# Altium project DIOT_8ch_isoSPI.PrjPCB (part 3 of 3)
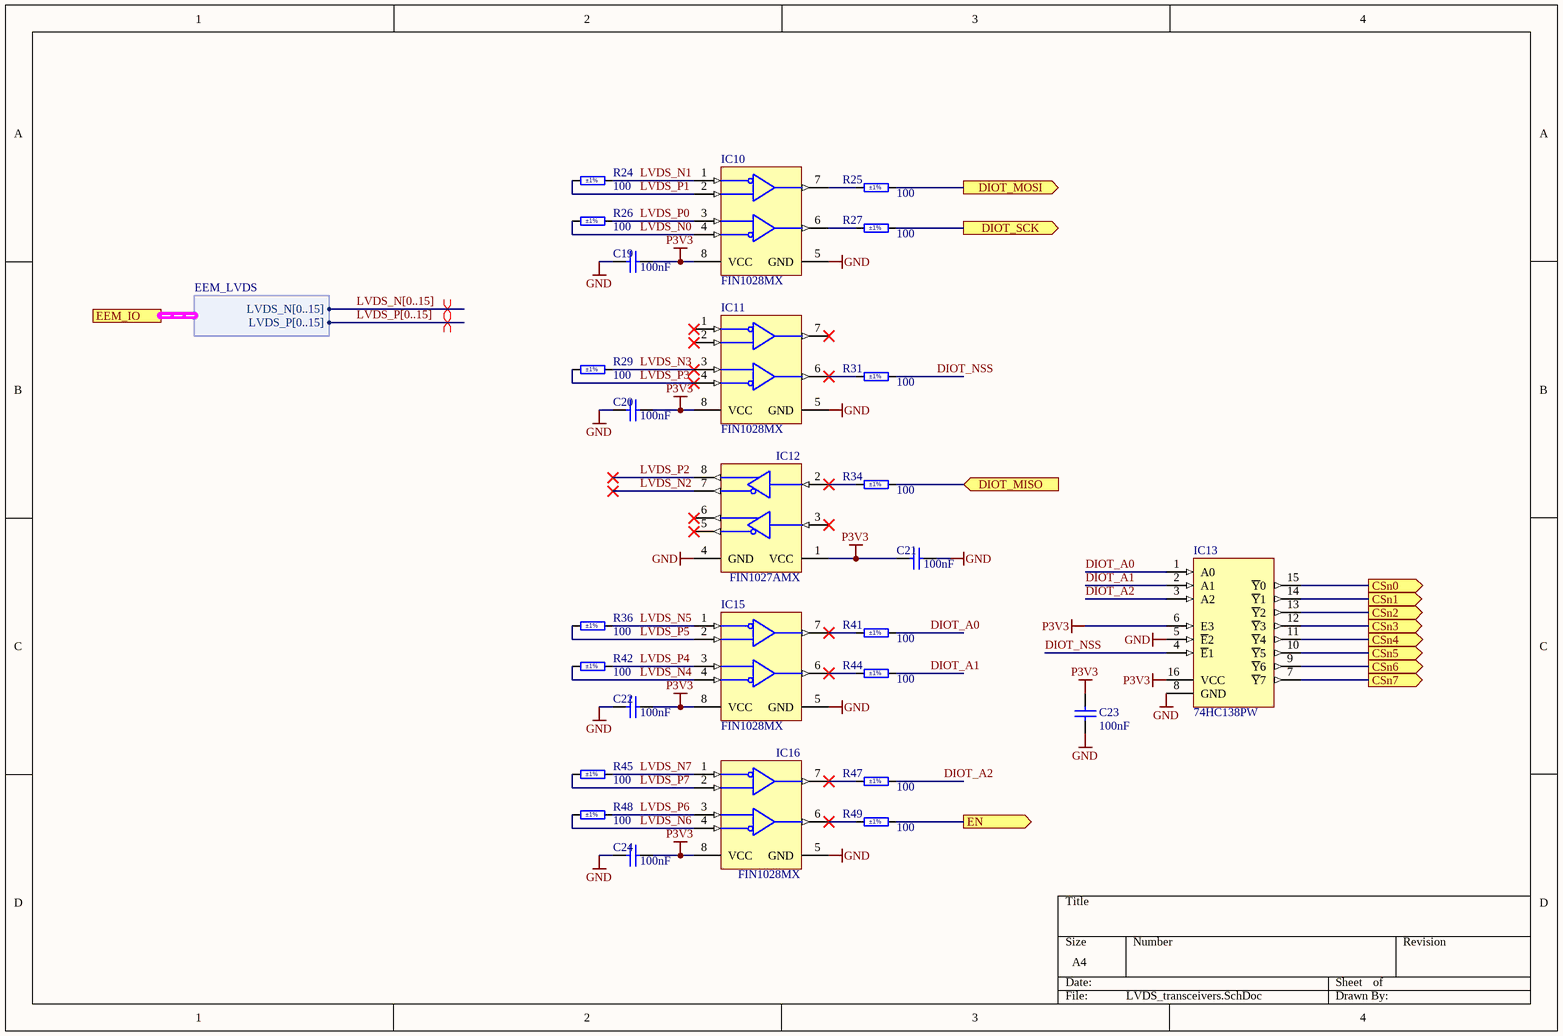
[diagram p6: LVDS_transceivers.SchDoc]

## Nets that join several sheets
GND: DIOT_8ch_isoSPI (35 pins), Power_Supplies (44 pins), CPCIS_Connectors_P1_P6 (66 pins), EEM_Connectors (35 pins), U_Iso_SPI_PHY_0 (13 pins), LVDS_transceivers (13 pins), U_Iso_SPI_PHY_1 (13 pins), U_Iso_SPI_PHY_2 (13 pins), U_Iso_SPI_PHY_3 (13 pins), U_Iso_SPI_PHY_4 (13 pins), U_Iso_SPI_PHY_5 (13 pins), U_Iso_SPI_PHY_6 (13 pins), U_Iso_SPI_PHY_7 (13 pins)
P3V3: Power_Supplies (5 pins), EEM_Connectors (C298.2 IC40.14), U_Iso_SPI_PHY_0 (11 pins), LVDS_transceivers (13 pins), U_Iso_SPI_PHY_1 (11 pins), U_Iso_SPI_PHY_2 (11 pins), U_Iso_SPI_PHY_3 (11 pins), U_Iso_SPI_PHY_4 (11 pins), U_Iso_SPI_PHY_5 (11 pins), U_Iso_SPI_PHY_6 (11 pins), U_Iso_SPI_PHY_7 (11 pins)
P3V3_DIOT: Power_Supplies (C102.1 D11.2 IC14.5), CPCIS_Connectors_P1_P6 (13 pins)
P3V3_MP: Power_Supplies (5 pins), EEM_Connectors (5 pins)
P5V0: Power_Supplies (C7.2 C9.1 L4.2), U_Iso_SPI_PHY_0 (F1A.2 T5A.2), U_Iso_SPI_PHY_1 (F1B.2 T5B.2), U_Iso_SPI_PHY_2 (F1C.2 T5C.2), U_Iso_SPI_PHY_3 (F1D.2 T5D.2), U_Iso_SPI_PHY_4 (F1E.2 T5E.2), U_Iso_SPI_PHY_5 (F1F.2 T5F.2), U_Iso_SPI_PHY_6 (F1G.2 T5G.2), U_Iso_SPI_PHY_7 (F1H.2 T5H.2)
P12V0: Power_Supplies (14 pins), EEM_Connectors (8 pins)
P12V0_DIOT: Power_Supplies (C40.2 IC14.1 IC14.3), CPCIS_Connectors_P1_P6 (7 pins), EEM_Connectors (R257.1 R260.1 R261.1 R262.1)
BP_I2C.SCL: CPCIS_Connectors_P1_P6 (D5.3 J6.B2), EEM_Connectors (R77.1)
BP_I2C.SDA: CPCIS_Connectors_P1_P6 (D5.1 J6.C2), EEM_Connectors (R3.1)
BP_IO.LVDS_N0: CPCIS_Connectors_P1_P6 (J6.E3), EEM_Connectors (R161.1)
BP_IO.LVDS_N1: CPCIS_Connectors_P1_P6 (J6.B3), EEM_Connectors (R162.1)
BP_IO.LVDS_N2: CPCIS_Connectors_P1_P6 (J6.C4), EEM_Connectors (R163.1)
BP_IO.LVDS_N3: CPCIS_Connectors_P1_P6 (J6.L4), EEM_Connectors (R164.1)
BP_IO.LVDS_N4: CPCIS_Connectors_P1_P6 (J6.I4), EEM_Connectors (R167.1)
BP_IO.LVDS_N5: CPCIS_Connectors_P1_P6 (J6.K5), EEM_Connectors (R168.1)
BP_IO.LVDS_N6: CPCIS_Connectors_P1_P6 (J6.H5), EEM_Connectors (R169.1)
BP_IO.LVDS_N7: CPCIS_Connectors_P1_P6 (J6.F6), EEM_Connectors (R170.1)
BP_IO.LVDS_N8: CPCIS_Connectors_P1_P6 (J6.C6), EEM_Connectors (R171.1)
BP_IO.LVDS_N9: CPCIS_Connectors_P1_P6 (J6.L6), EEM_Connectors (R172.1)
BP_IO.LVDS_N10: CPCIS_Connectors_P1_P6 (J6.I6), EEM_Connectors (R173.1)
BP_IO.LVDS_N11: CPCIS_Connectors_P1_P6 (J7.E1), EEM_Connectors (R174.1)
BP_IO.LVDS_N12: CPCIS_Connectors_P1_P6 (J7.B1), EEM_Connectors (R175.1)
BP_IO.LVDS_N13: CPCIS_Connectors_P1_P6 (J7.K1), EEM_Connectors (R176.1)
BP_IO.LVDS_N14: CPCIS_Connectors_P1_P6 (J7.H1), EEM_Connectors (R177.1)
BP_IO.LVDS_N15: CPCIS_Connectors_P1_P6 (J6.F2), EEM_Connectors (R144.2)
BP_IO.LVDS_P0: CPCIS_Connectors_P1_P6 (J6.D3), EEM_Connectors (R145.1)
BP_IO.LVDS_P1: CPCIS_Connectors_P1_P6 (J6.A3), EEM_Connectors (R146.1)
BP_IO.LVDS_P2: CPCIS_Connectors_P1_P6 (J6.B4), EEM_Connectors (R147.1)
BP_IO.LVDS_P3: CPCIS_Connectors_P1_P6 (J6.K4), EEM_Connectors (R148.1)
BP_IO.LVDS_P4: CPCIS_Connectors_P1_P6 (J6.H4), EEM_Connectors (R149.1)
BP_IO.LVDS_P5: CPCIS_Connectors_P1_P6 (J6.J5), EEM_Connectors (R150.1)
BP_IO.LVDS_P6: CPCIS_Connectors_P1_P6 (J6.G5), EEM_Connectors (R151.1)
BP_IO.LVDS_P7: CPCIS_Connectors_P1_P6 (J6.E6), EEM_Connectors (R152.1)
BP_IO.LVDS_P8: CPCIS_Connectors_P1_P6 (J6.B6), EEM_Connectors (R5.1)
BP_IO.LVDS_P9: CPCIS_Connectors_P1_P6 (J6.K6), EEM_Connectors (R6.1)
BP_IO.LVDS_P10: CPCIS_Connectors_P1_P6 (J6.H6), EEM_Connectors (R7.1)
BP_IO.LVDS_P11: CPCIS_Connectors_P1_P6 (J7.D1), EEM_Connectors (R156.1)
BP_IO.LVDS_P12: CPCIS_Connectors_P1_P6 (J7.A1), EEM_Connectors (R157.1)
BP_IO.LVDS_P13: CPCIS_Connectors_P1_P6 (J7.J1), EEM_Connectors (R158.1)
BP_IO.LVDS_P14: CPCIS_Connectors_P1_P6 (J7.G1), EEM_Connectors (R159.1)
BP_IO.LVDS_P15: CPCIS_Connectors_P1_P6 (J6.E2), EEM_Connectors (R143.2)
CSn0: U_Iso_SPI_PHY_0 (IC5A.5 IC7A.1), LVDS_transceivers (IC13.15)
CSn1: LVDS_transceivers (IC13.14), U_Iso_SPI_PHY_1 (IC5B.5 IC7B.1)
CSn2: LVDS_transceivers (IC13.13), U_Iso_SPI_PHY_2 (IC5C.5 IC7C.1)
CSn3: LVDS_transceivers (IC13.12), U_Iso_SPI_PHY_3 (IC5D.5 IC7D.1)
CSn4: LVDS_transceivers (IC13.11), U_Iso_SPI_PHY_4 (IC5E.5 IC7E.1)
CSn5: LVDS_transceivers (IC13.10), U_Iso_SPI_PHY_5 (IC5F.5 IC7F.1)
CSn6: LVDS_transceivers (IC13.9), U_Iso_SPI_PHY_6 (IC5G.5 IC7G.1)
CSn7: LVDS_transceivers (IC13.7), U_Iso_SPI_PHY_7 (IC5H.5 IC7H.1)
EEM0_I2C.SCL: Power_Supplies (IC33.2), EEM_Connectors (6 pins)
EEM0_I2C.SDA: Power_Supplies (IC33.1), EEM_Connectors (6 pins)
EEM_IO.LVDS_N0: EEM_Connectors (J8.3 R161.2), LVDS_transceivers (IC10.4 R26.2)
EEM_IO.LVDS_N1: EEM_Connectors (J8.6 R162.2), LVDS_transceivers (IC10.1 R24.1)
EEM_IO.LVDS_N2: EEM_Connectors (J8.9 R163.2), LVDS_transceivers (IC12.7)
EEM_IO.LVDS_N3: EEM_Connectors (J8.12 R164.2), LVDS_transceivers (IC11.3 R29.1)
EEM_IO.LVDS_N4: EEM_Connectors (J8.15 R167.2), LVDS_transceivers (IC15.4 R42.2)
EEM_IO.LVDS_N5: EEM_Connectors (J8.18 R168.2), LVDS_transceivers (IC15.1 R36.1)
EEM_IO.LVDS_N6: EEM_Connectors (J8.21 R169.2), LVDS_transceivers (IC16.4 R48.2)
EEM_IO.LVDS_N7: EEM_Connectors (J8.24 R170.2), LVDS_transceivers (IC16.1 R45.1)
EEM_IO.LVDS_P0: EEM_Connectors (J8.2 R145.2), LVDS_transceivers (IC10.3 R26.1)
EEM_IO.LVDS_P1: EEM_Connectors (J8.5 R146.2), LVDS_transceivers (IC10.2 R24.2)
EEM_IO.LVDS_P2: EEM_Connectors (J8.8 R147.2), LVDS_transceivers (IC12.8)
EEM_IO.LVDS_P3: EEM_Connectors (J8.11 R148.2), LVDS_transceivers (IC11.4 R29.2)
EEM_IO.LVDS_P4: EEM_Connectors (J8.14 R149.2), LVDS_transceivers (IC15.3 R42.1)
EEM_IO.LVDS_P5: EEM_Connectors (J8.17 R150.2), LVDS_transceivers (IC15.2 R36.2)
EEM_IO.LVDS_P6: EEM_Connectors (J8.20 R151.2), LVDS_transceivers (IC16.3 R48.1)
EEM_IO.LVDS_P7: EEM_Connectors (J8.23 R152.2), LVDS_transceivers (IC16.2 R45.2)
ISO_N: DIOT_8ch_isoSPI (TR2.2), U_Iso_SPI_PHY_3 (D3D.3 IC5D.10 R13D.2)
ISO_N: DIOT_8ch_isoSPI (TR2.5), U_Iso_SPI_PHY_2 (D3C.3 IC5C.10 R13C.2)
ISO_N: DIOT_8ch_isoSPI (TR2.8), U_Iso_SPI_PHY_1 (D3B.3 IC5B.10 R13B.2)
ISO_N: DIOT_8ch_isoSPI (TR2.11), U_Iso_SPI_PHY_0 (D3A.3 IC5A.10 R13A.2)
ISO_N: DIOT_8ch_isoSPI (TR3.2), U_Iso_SPI_PHY_7 (D3H.3 IC5H.10 R13H.2)
ISO_N: DIOT_8ch_isoSPI (TR3.5), U_Iso_SPI_PHY_6 (D3G.3 IC5G.10 R13G.2)
ISO_N: DIOT_8ch_isoSPI (TR3.8), U_Iso_SPI_PHY_5 (D3F.3 IC5F.10 R13F.2)
ISO_N: DIOT_8ch_isoSPI (TR3.11), U_Iso_SPI_PHY_4 (D3E.3 IC5E.10 R13E.2)
ISO_P: DIOT_8ch_isoSPI (TR2.3), U_Iso_SPI_PHY_3 (D3D.1 IC5D.11 R13D.1)
ISO_P: DIOT_8ch_isoSPI (TR2.6), U_Iso_SPI_PHY_2 (D3C.1 IC5C.11 R13C.1)
ISO_P: DIOT_8ch_isoSPI (TR2.9), U_Iso_SPI_PHY_1 (D3B.1 IC5B.11 R13B.1)
ISO_P: DIOT_8ch_isoSPI (TR2.12), U_Iso_SPI_PHY_0 (D3A.1 IC5A.11 R13A.1)
ISO_P: DIOT_8ch_isoSPI (TR3.3), U_Iso_SPI_PHY_7 (D3H.1 IC5H.11 R13H.1)
ISO_P: DIOT_8ch_isoSPI (TR3.6), U_Iso_SPI_PHY_6 (D3G.1 IC5G.11 R13G.1)
ISO_P: DIOT_8ch_isoSPI (TR3.9), U_Iso_SPI_PHY_5 (D3F.1 IC5F.11 R13F.1)
ISO_P: DIOT_8ch_isoSPI (TR3.12), U_Iso_SPI_PHY_4 (D3E.1 IC5E.11 R13E.1)
LEDG0: DIOT_8ch_isoSPI (LD3.2), U_Iso_SPI_PHY_0 (R22A.2)
LEDG1: DIOT_8ch_isoSPI (LD6.2), U_Iso_SPI_PHY_1 (R22B.2)
LEDG2: DIOT_8ch_isoSPI (LD8.2), U_Iso_SPI_PHY_2 (R22C.2)
LEDG3: DIOT_8ch_isoSPI (LD10.2), U_Iso_SPI_PHY_3 (R22D.2)
LEDG4: DIOT_8ch_isoSPI (LD12.2), U_Iso_SPI_PHY_4 (R22E.2)
LEDG5: DIOT_8ch_isoSPI (LD14.2), U_Iso_SPI_PHY_5 (R22F.2)
LEDG6: DIOT_8ch_isoSPI (LD16.2), U_Iso_SPI_PHY_6 (R22G.2)
LEDG7: DIOT_8ch_isoSPI (LD18.2), U_Iso_SPI_PHY_7 (R22H.2)
LEDR0: DIOT_8ch_isoSPI (LD5.2), U_Iso_SPI_PHY_0 (R21A.1)
LEDR1: DIOT_8ch_isoSPI (LD7.2), U_Iso_SPI_PHY_1 (R21B.1)
LEDR2: DIOT_8ch_isoSPI (LD9.2), U_Iso_SPI_PHY_2 (R21C.1)
LEDR3: DIOT_8ch_isoSPI (LD11.2), U_Iso_SPI_PHY_3 (R21D.1)
LEDR4: DIOT_8ch_isoSPI (LD13.2), U_Iso_SPI_PHY_4 (R21E.1)
LEDR5: DIOT_8ch_isoSPI (LD15.2), U_Iso_SPI_PHY_5 (R21F.1)
LEDR6: DIOT_8ch_isoSPI (LD17.2), U_Iso_SPI_PHY_6 (R21G.1)
LEDR7: DIOT_8ch_isoSPI (LD19.2), U_Iso_SPI_PHY_7 (R21H.1)
NetC25A_2: DIOT_8ch_isoSPI (L5.1 TR2.15), U_Iso_SPI_PHY_0 (C25A.2 F1A.1 R20A.2)
NetC25B_2: DIOT_8ch_isoSPI (L6.1 TR2.18), U_Iso_SPI_PHY_1 (C25B.2 F1B.1 R20B.2)
NetC25C_2: DIOT_8ch_isoSPI (L7.1 TR2.21), U_Iso_SPI_PHY_2 (C25C.2 F1C.1 R20C.2)
NetC25D_2: DIOT_8ch_isoSPI (L8.1 TR2.24), U_Iso_SPI_PHY_3 (C25D.2 F1D.1 R20D.2)
NetC25E_2: DIOT_8ch_isoSPI (L9.1 TR3.15), U_Iso_SPI_PHY_4 (C25E.2 F1E.1 R20E.2)
NetC25F_2: DIOT_8ch_isoSPI (L10.1 TR3.18), U_Iso_SPI_PHY_5 (C25F.2 F1F.1 R20F.2)
NetC25G_2: DIOT_8ch_isoSPI (L11.1 TR3.21), U_Iso_SPI_PHY_6 (C25G.2 F1G.1 R20G.2)
NetC25H_2: DIOT_8ch_isoSPI (L12.1 TR3.24), U_Iso_SPI_PHY_7 (C25H.2 F1H.1 R20H.2)
NetIC5A_1: U_Iso_SPI_PHY_0 (IC5A.1), LVDS_transceivers (R49.1), U_Iso_SPI_PHY_1 (IC5B.1), U_Iso_SPI_PHY_2 (IC5C.1), U_Iso_SPI_PHY_3 (IC5D.1), U_Iso_SPI_PHY_4 (IC5E.1), U_Iso_SPI_PHY_5 (IC5F.1), U_Iso_SPI_PHY_6 (IC5G.1), U_Iso_SPI_PHY_7 (IC5H.1)
NetIC5A_2: U_Iso_SPI_PHY_0 (IC5A.2), LVDS_transceivers (R25.1), U_Iso_SPI_PHY_1 (IC5B.2), U_Iso_SPI_PHY_2 (IC5C.2), U_Iso_SPI_PHY_3 (IC5D.2), U_Iso_SPI_PHY_4 (IC5E.2), U_Iso_SPI_PHY_5 (IC5F.2), U_Iso_SPI_PHY_6 (IC5G.2), U_Iso_SPI_PHY_7 (IC5H.2)
NetIC5A_4: U_Iso_SPI_PHY_0 (IC5A.4), LVDS_transceivers (R27.1), U_Iso_SPI_PHY_1 (IC5B.4), U_Iso_SPI_PHY_2 (IC5C.4), U_Iso_SPI_PHY_3 (IC5D.4), U_Iso_SPI_PHY_4 (IC5E.4), U_Iso_SPI_PHY_5 (IC5F.4), U_Iso_SPI_PHY_6 (IC5G.4), U_Iso_SPI_PHY_7 (IC5H.4)
NetIC7A_4: U_Iso_SPI_PHY_0 (IC7A.4), LVDS_transceivers (R34.1), U_Iso_SPI_PHY_1 (IC7B.4), U_Iso_SPI_PHY_2 (IC7C.4), U_Iso_SPI_PHY_3 (IC7D.4), U_Iso_SPI_PHY_4 (IC7E.4), U_Iso_SPI_PHY_5 (IC7F.4), U_Iso_SPI_PHY_6 (IC7G.4), U_Iso_SPI_PHY_7 (IC7H.4)
PGOOD: Power_Supplies (IC1.7 IC4.7), CPCIS_Connectors_P1_P6 (R40.1 T2.1)
PSU_EN: Power_Supplies (IC1.8 IC4.8 R187.1 R188.2), CPCIS_Connectors_P1_P6 (R33.2)
SERVMOD_3V3: CPCIS_Connectors_P1_P6 (R55.2 R138.1), EEM_Connectors (IC40.5 IC40.6 IC40.12 IC40.13)

## Assembly variants
EEM: all parts fitted
DIOT: all parts fitted